# EAGLE design schematics (EAGLE 8.1.1)
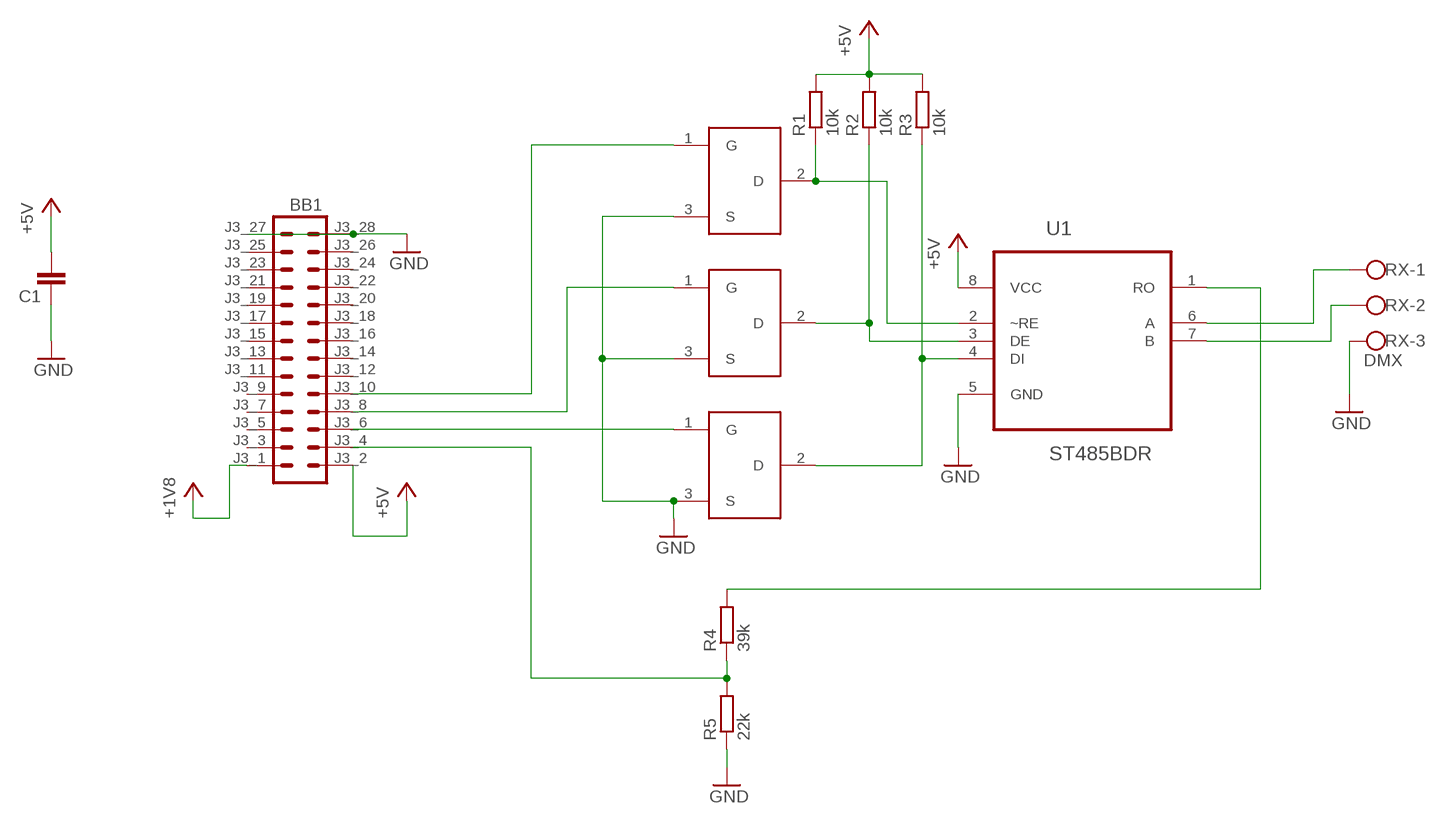
[diagram p0: schematic, sheet 1]

## Parts
BB1  BEAGLE_EXPANSION  [BEAGLE_EXPANSION]
C1  C-EUC0603  [C0603]
R1  10k  R-EU_R0603  [R0603]
R2  10k  R-EU_R0603  [R0603]
R3  10k  R-EU_R0603  [R0603]
R4  39k  R-EU_R0603  [R0603]
R5  22k  R-EU_R0603  [R0603]
RX  DMX  W237-103  [W237-103]
U1  ST485BDR  [SOIC127P600X175-8N]
U$1  SI1012CR-T1-GE3  [SC75]
U$2  SI1012CR-T1-GE3  [SC75]
U$3  SI1012CR-T1-GE3  [SC75]

## Nets
+3V3: BB1.J3_1 ; supply symbol labelled +1V8
+5V: BB1.J3_2 C1.2 R1.2 R2.2 R3.2 U1.8(VCC)
GND: BB1.J3_27 BB1.J3_28 C1.1 R5.1 RX.3 U1.5(GND) U$1.3(S) U$2.3(S) U$3.3(S)
N$1: R1.1 U1.2(~RE) U$1.2(D)
N$2: R2.1 U1.3(DE) U$3.2(D)
N$6: BB1.J3_4 R4.1 R5.2
N$7: R3.1 U1.4(DI) U$2.2(D)
N$9: BB1.J3_6 U$2.1(G)
N$10: BB1.J3_8 U$3.1(G)
N$11: BB1.J3_10 U$1.1(G)
N$12: R4.2 U1.1(RO)
N$13: RX.1 U1.6(A)
N$14: RX.2 U1.7(B)
Unconnected: BB1.J3_3 BB1.J3_5 BB1.J3_7 BB1.J3_9 BB1.J3_11 BB1.J3_12 BB1.J3_13 BB1.J3_14 BB1.J3_15 BB1.J3_16 BB1.J3_17 BB1.J3_18 BB1.J3_19 BB1.J3_20 BB1.J3_21 BB1.J3_22 BB1.J3_23 BB1.J3_24 BB1.J3_25 BB1.J3_26

## Library data of the parts
BB1 = beagleboardc4:BEAGLE_EXPANSION: BeagleBoard C4 Expansion Provides pinouts for J3, J4, and J5. J3 is the main expansion header. J4 is the first LCD connector. J5 is the second LCD connector.
C1 = extension:C-EU: CAPACITOR, European symbol
R1-R5 = extension:R-EU_: RESISTOR, European symbol
RX = extension:W237-103: WAGO SCREW CLAMP; MPN: 237-103; OC_FARNELL: unknown; OC_NEWARK: 18M7116
U1 = ST485BDR:ST485BDR: Transceiver; AVAILABILITY: Good; DESCRIPTION: ST485B 5 V 2.5 Mbps Low Power RS-485/RS-422 Transceiver - SOIC-8 (- 40 to 85 °C); MF: STMicroelectronics; MP: ST485BDR; PACKAGE: SOIC-8 STMicroelectronics; PRICE: Average Price: $0.44 USD
U$1-U$3 = SC75:SI1012CR-T1-GE3

## Board
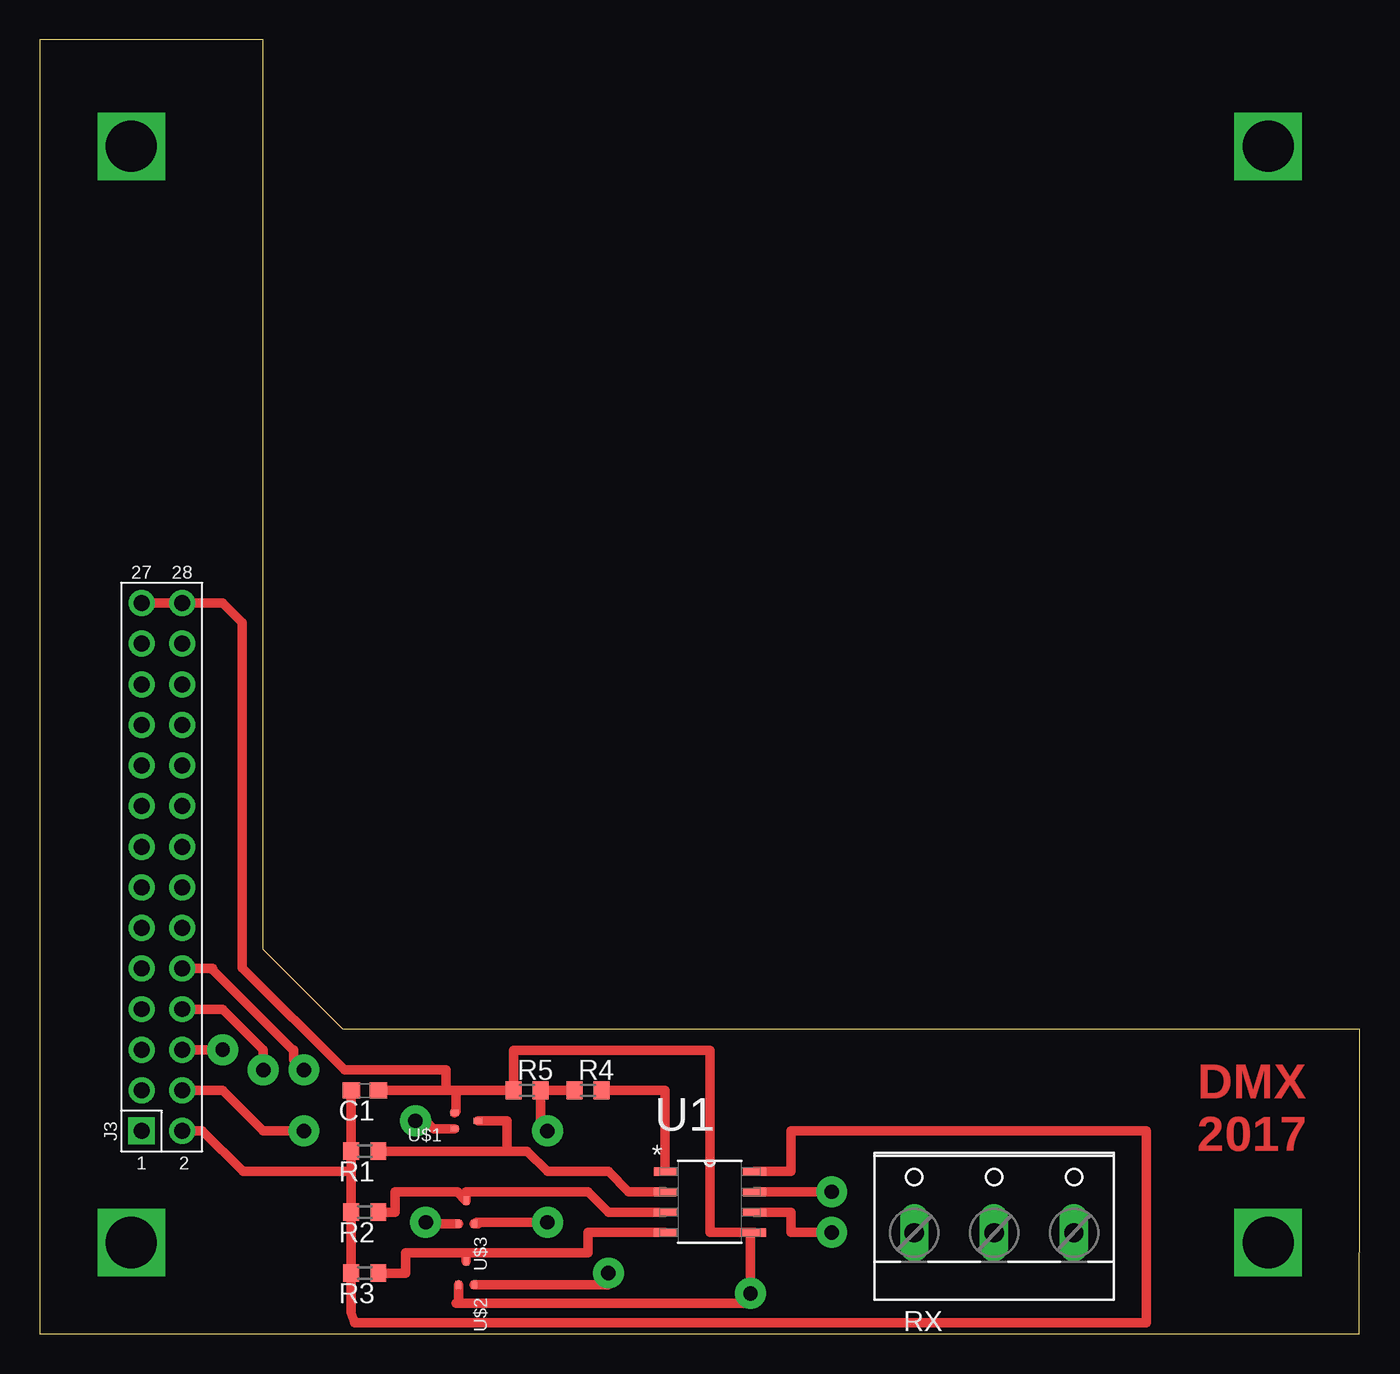
[diagram p1: board, top side]
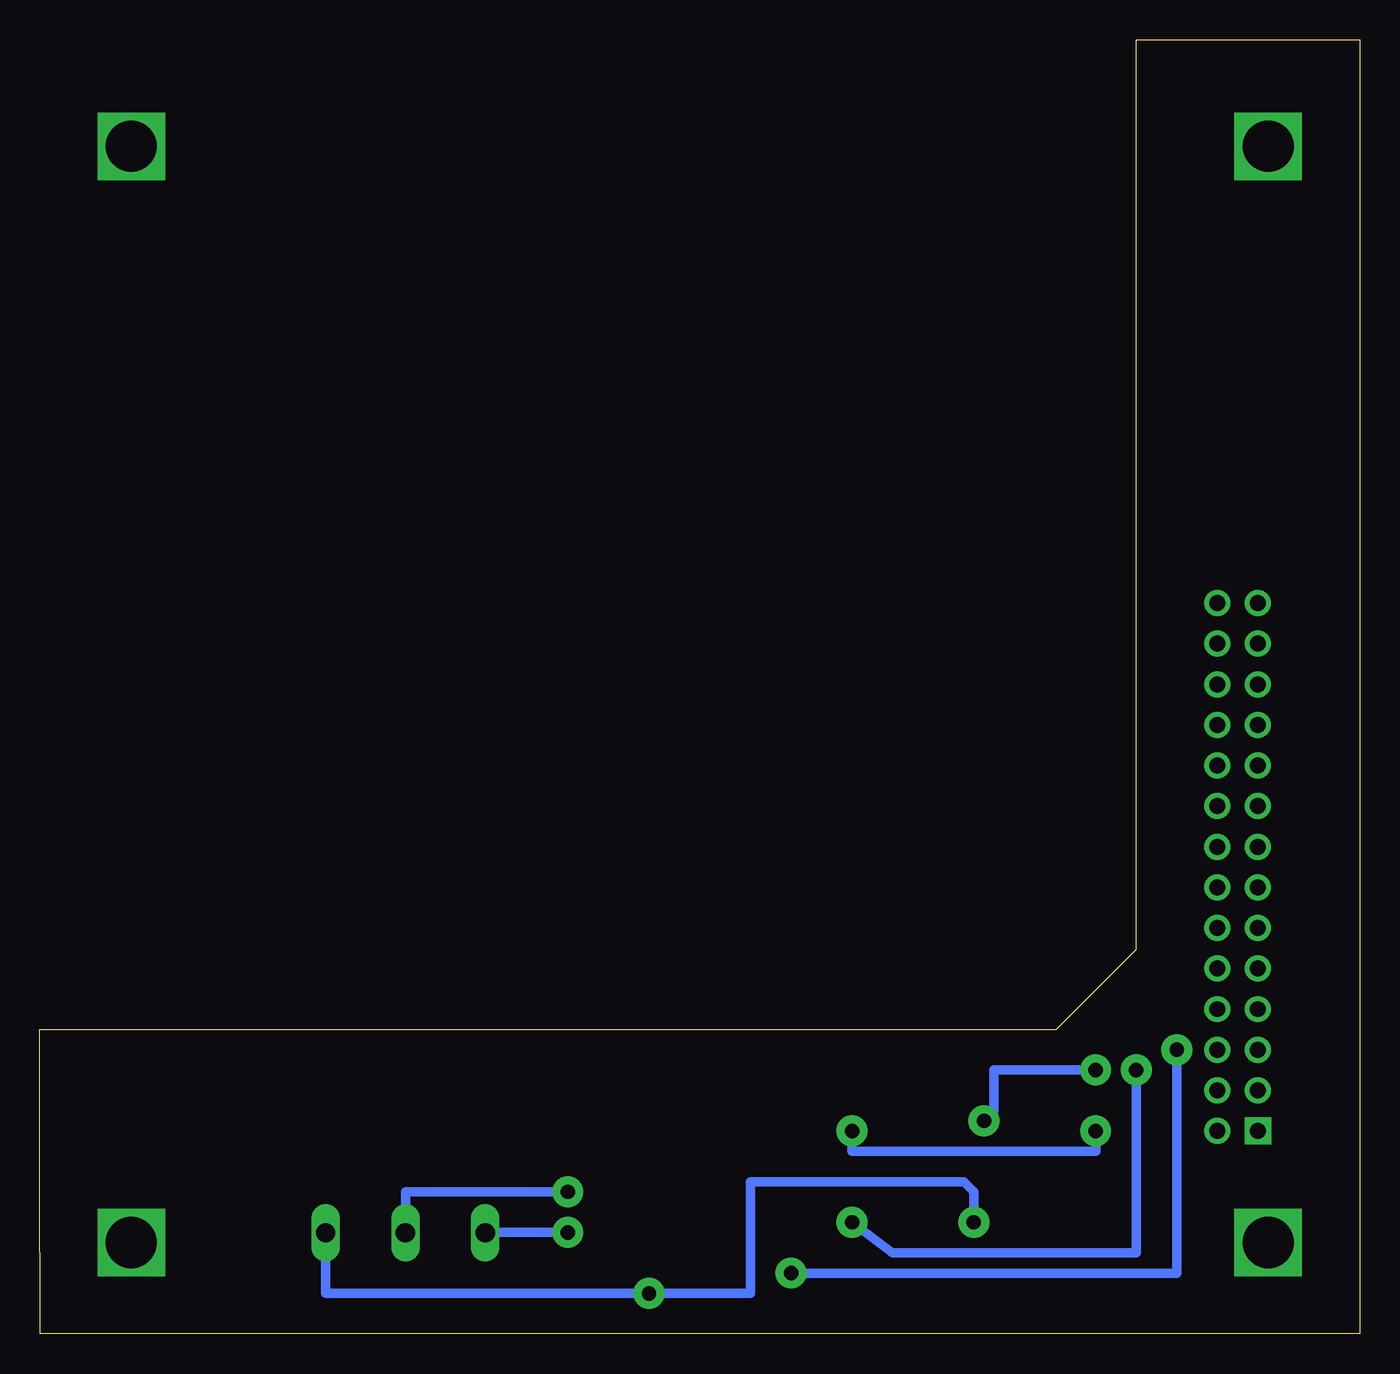
[diagram p2: board, bottom side, seen from below]

Size 82.55 x 80.95 mm. Coordinates in mm from the lower left corner, seen from the top.
Outline: 0,0 82.53,0 82.55,10.16 82.55,19.05 18.97,19.05 13.97,24.05 13.97,80.95 0,80.95 0,0
Copper layers (1*16): Top 0.035mm / dielectric 1.5mm / Bottom 0.035mm
Design rules "default": minimum track width 10mil, minimum drill 24mil, track to track 8mil, track to pad 8mil, pad to pad 8mil, via to via 8mil, smd to smd 8mil, copper to edge 40mil, drill to drill 8mil, minimum pad ring 10mil, minimum via ring 8mil, stop-mask expansion 4mil, vias tented up to drill 0mil, thermal gap 10mil

### Footprints (pad centres in the part's own frame; a part is rotated, then mirrored left to right if it is on the bottom)
BEAGLE_EXPANSION = drill 1 pad 1.676 square: J3_1 0,0 | drill 1 pad 1.625: J3_2 2.54,0; J3_3 0,2.54; J3_4 2.54,2.54; J3_5 0,5.08; J3_6 2.54,5.08; J3_7 0,7.62; J3_8 2.54,7.62; J3_9 0,10.16; J3_10 2.54,10.16; J3_11 0,12.7; J3_12 2.54,12.7; J3_13 0,15.24; J3_14 2.54,15.24; J3_15 0,17.78; J3_16 2.54,17.78; J3_17 0,20.32; J3_18 2.54,20.32; J3_19 0,22.86; J3_20 2.54,22.86; J3_21 0,25.4; J3_22 2.54,25.4; J3_23 0,27.94; J3_24 2.54,27.94; J3_25 0,30.48; J3_26 2.54,30.48; J3_27 0,33.02; J3_28 2.54,33.02 | drill 3.2 square: P$69 -0.635,-6.985; P$70 70.485,-6.985; P$71 70.485,61.595; P$72 -0.635,61.595
C0603 = smd 1.1 x 1: 1 -0.85,0; 2 0.85,0
R0603 = smd 1 x 1.1: 1 -0.85,0; 2 0.85,0
W237-103 = drill 1.194 long: 1 -5,-1.29; 2 0,-1.29; 3 5,-1.29
SOIC127P600X175-8N = smd 1.422 x 0.533: 1 -2.794,1.905; 2 -2.794,0.635; 3 -2.794,-0.635; 4 -2.794,-1.905; 5 2.794,-1.905; 6 2.794,-0.635; 7 2.794,0.635; 8 2.794,1.905
SC75 = smd 0.508 x 0.356: 1 0.724,0.495; 2 -0.724,0; 3 0.724,-0.495

### Placement (x,y rotation side)
BB1  6.35,12.7 0 top
C1  20.32,15.24 180 top
R1  20.32,11.43 180 top
R2  20.32,7.62 180 top
R3  20.32,3.81 180 top
R4  34.29,15.24 0 top
R5  30.48,15.24 0 top
RX  59.69,7.62 0 top
U1  41.91,8.26 0 top
U$1  26.67,13.34 180 top
U$2  26.67,3.81 270 top
U$3  26.67,7.62 270 top

### Tracks (layer width: path | path; a pad name or v marks a point on that pad's centre or on a via)
+5V
  Top 0.61: C1.2 R1.2 19.47,10.16 | 19.47,10.16 R2.2 R3.2 19.47,1.32 19.68,0.69 69.22,0.69 69.22,12.7 46.99,12.7 46.99,10.16 U1.8 | BB1.J3_2 10.16,12.7 12.7,10.16 19.47,10.16
GND  (via drill 0.9 pad 1.93)
  Top 0.61: BB1.J3_27 BB1.J3_28 11.43,45.72 12.65,44.5 12.65,22.91 19.05,16.51 25.4,16.51 25.4,15.24 | 25.4,15.24 C1.1 | 25.4,15.24 26.04,15.24 | 26.04,15.24 R5.1 29.63,17.73 41.91,17.73 41.91,6.35 44.45,6.35 | U1.5 44.45,6.35 | 44.45,6.35 v44.45,2.54 44.45,1.91 26.18,1.91 | U$3.3 24.13,6.9 v24.13,6.99 | 26.04,1.91 26.18,1.91 | 26.18,1.91 U$2.3 | U$1.3 26.04,13.92 26.04,15.24
  Bottom 0.61: RX.3 64.69,2.54 v44.45,2.54 38.1,2.54 38.1,9.53 24.77,9.53 24.13,8.89 v24.13,6.99
N$1
  Top 0.61: U1.2 36.83,8.89 35.56,10.16 31.75,10.16 30.48,11.43 29.21,11.43 | 29.21,11.43 29.21,13.34 U$1.2 | R1.1 29.21,11.43
N$2
  Top 0.61: R2.1 22.23,7.62 22.23,8.89 26.12,8.89 U$3.2 26.67,8.89 34.29,8.89 35.56,7.62 U1.3
N$6  (via drill 0.9 pad 1.93)
  Top 0.61: BB1.J3_4 11.43,15.24 13.97,12.7 v16.51,12.7 | v31.75,12.7 31.33,12.7 R5.2 R4.1
  Bottom 0.61: v16.51,12.7 16.51,11.43 31.75,11.43 v31.75,12.7
N$7
  Top 0.61: R3.1 22.86,3.81 22.86,5.08 26.67,5.08 | 26.67,5.08 U$2.2 | U1.4 34.29,6.35 34.29,5.08 26.67,5.08
N$9  (via drill 0.9 pad 1.93)
  Top 0.61: U$2.1 35.56,3.09 v35.56,3.81 | v11.43,17.78 BB1.J3_6
  Bottom 0.61: v35.56,3.81 11.43,3.81 v11.43,17.78
N$10  (via drill 0.9 pad 1.93)
  Top 0.61: U$3.1 27.39,6.9 27.3,6.99 v31.75,6.99 | v13.97,16.51 13.97,17.78 11.43,20.32 BB1.J3_8
  Bottom 0.61: v31.75,6.99 29.21,5.08 13.97,5.08 v13.97,16.51
N$11  (via drill 0.9 pad 1.93)
  Top 0.61: U$1.1 24.62,12.84 24.13,13.34 v23.5,13.34 | v16.51,16.51 15.88,17.14 15.88,17.78 15.8,17.78 10.79,22.78 10.79,22.86 BB1.J3_10
  Bottom 0.61: v23.5,13.34 22.86,13.97 22.86,16.51 v16.51,16.51
N$12
  Top 0.61: R4.2 39.12,15.24 U1.1
N$13  (via drill 0.9 pad 1.93)
  Top 0.61: U1.6 46.99,7.62 46.99,6.35 v49.53,6.35
  Bottom 0.61: v49.53,6.35 54.69,6.35 RX.1
N$14  (via drill 0.9 pad 1.93)
  Top 0.61: v49.53,8.89 U1.7
  Bottom 0.61: RX.2 59.69,8.89 v49.53,8.89

### Text on the board
Top: DMX / 2017